# EAGLE design Diplexer (EAGLE 7.1.0)
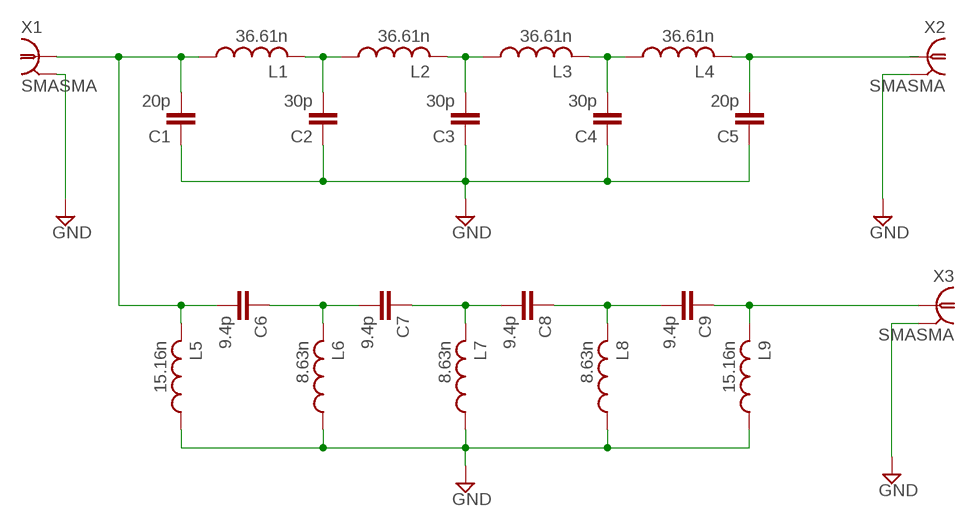
[diagram p0: schematic, sheet 1]

## Parts
C1  20p  C-EUC1206  [C1206]
C2  30p  C-EUC1206  [C1206]
C3  30p  C-EUC1206  [C1206]
C4  30p  C-EUC1206  [C1206]
C5  20p  C-EUC1206  [C1206]
C6  9.4p  C-EUC1206  [C1206]
C7  9.4p  C-EUC1206  [C1206]
C8  9.4p  C-EUC1206  [C1206]
C9  9.4p  C-EUC1206  [C1206]
L1  36.61n  AIR_CORE_INDUCTORL1812  [AIR_CORE_INDUCTOR]
L2  36.61n  AIR_CORE_INDUCTORL1812  [AIR_CORE_INDUCTOR]
L3  36.61n  AIR_CORE_INDUCTORL1812  [AIR_CORE_INDUCTOR]
L4  36.61n  AIR_CORE_INDUCTORL1812  [AIR_CORE_INDUCTOR]
L5  15.16n  AIR_CORE_INDUCTORL1812  [AIR_CORE_INDUCTOR]
L6  8.63n  AIR_CORE_INDUCTORL1812  [AIR_CORE_INDUCTOR]
L7  8.63n  AIR_CORE_INDUCTORL1812  [AIR_CORE_INDUCTOR]
L8  8.63n  AIR_CORE_INDUCTORL1812  [AIR_CORE_INDUCTOR]
L9  15.16n  AIR_CORE_INDUCTORL1812  [AIR_CORE_INDUCTOR]
X1  SMASMA  [SMA]
X2  SMASMA  [SMA]
X3  SMASMA  [SMA]

## Nets
GND: C1.1 C2.1 C3.1 C4.1 C5.1 L5.1 L6.1 L7.1 L8.1 L9.1 X1.2 X1.4 X2.2 X2.4 X3.2 X3.4
N$1: C1.2 C6.2 L1.1 L5.2 X1.1
N$2: C2.2 L1.2 L2.1
N$3: C3.2 L2.2 L3.1
N$4: C4.2 L3.2 L4.1
N$5: C5.2 L4.2 X2.1
N$8: C6.1 C7.2 L6.2
N$9: C7.1 C8.2 L7.2
N$10: C8.1 C9.2 L8.2
N$11: C9.1 L9.2 X3.1

## Library data of the parts
C1-C9 = satnogs:C-EU: CAPACITOR, European symbol
L1-L9 = satnogs:AIR_CORE_INDUCTOR: INDUCTOR
X1-X3 = satnogs:SMA: SMA CONNECTOR 50 Ohm

## Board
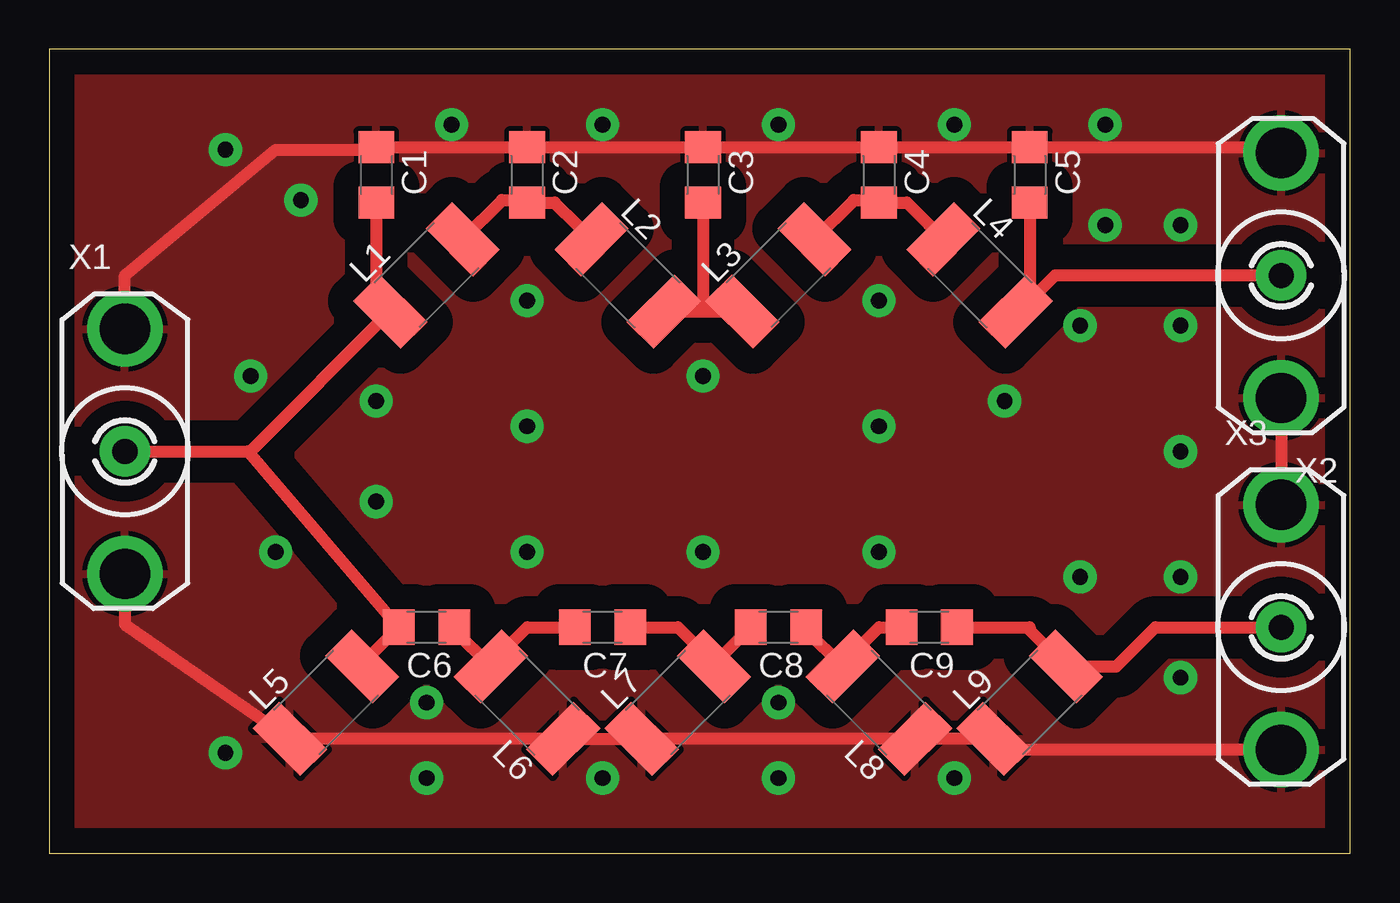
[diagram p1: board, top side]
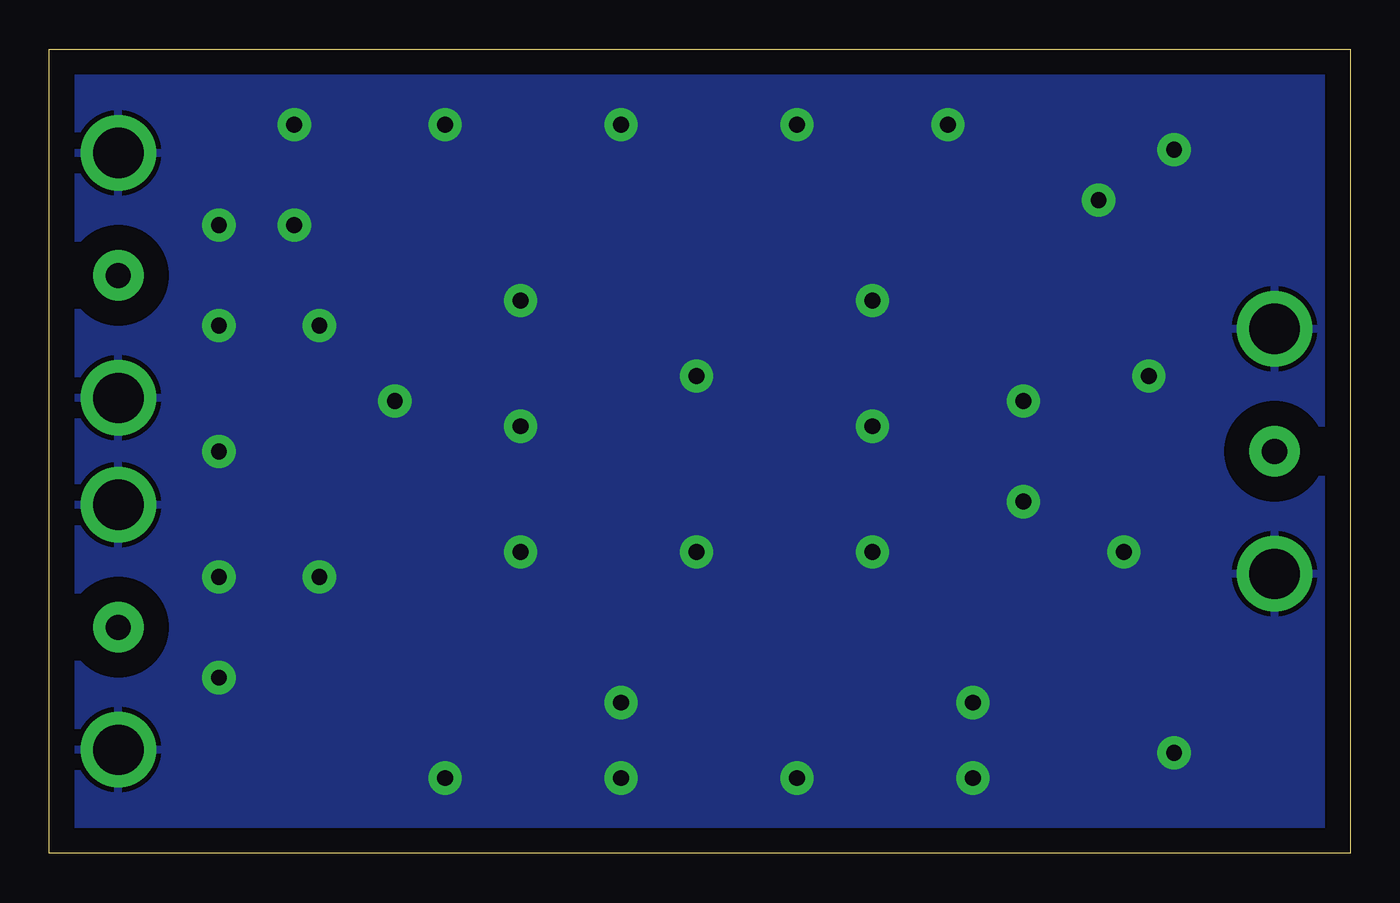
[diagram p2: board, bottom side, seen from below]

Size 65.71 x 40.63 mm. Coordinates in mm from the lower left corner, seen from the top.
Outline: 0,0 65.71,0 65.71,40.63 0,40.63 0,0
Copper layers (1*16): Top 0.035mm / dielectric 1.5mm / Bottom 0.035mm
Design rules "default": minimum track width 10mil, minimum drill 24mil, track to track 8mil, track to pad 8mil, pad to pad 8mil, via to via 8mil, smd to smd 8mil, copper to edge 40mil, drill to drill 8mil, minimum pad ring 10mil, minimum via ring 8mil, stop-mask expansion 4mil, vias tented up to drill 0mil, thermal gap 10mil

### Footprints (pad centres in the part's own frame; a part is rotated, then mirrored left to right if it is on the bottom)
C1206 = smd 1.6 x 1.8: 1 -1.4,0; 2 1.4,0
AIR_CORE_INDUCTOR = smd 1.9 x 3.4: 1 -2.585,0; 2 2.585,0
SMA = drill 1.27 pad 2.54: 1 0,0 | drill 2.54 pad 3.81: 2 0,6.191; 4 0,-6.191

### Placement (x,y rotation side)
C1  16.51,34.29 270 top
C2  24.13,34.29 270 top
C3  33.02,34.29 270 top
C4  41.91,34.29 270 top
C5  49.53,34.29 270 top
C6  19.05,11.43 180 top
C7  27.94,11.43 180 top
C8  36.83,11.43 180 top
C9  44.45,11.43 180 top
L1  19.05,29.21 45 top
L2  29.21,29.21 315 top
L3  36.83,29.21 45 top
L4  46.99,29.21 315 top
L5  13.97,7.62 45 top
L6  24.13,7.62 135 top
L7  31.75,7.62 45 top
L8  41.91,7.62 135 top
L9  49.53,7.62 45 top
X1  3.81,20.32 0 top
X2  62.23,29.21 180 top
X3  62.23,11.43 0 top

### Tracks (layer width: path | path; a pad name or v marks a point on that pad's centre or on a via)
GND  (via drill 0.8 pad 1.68)
  Top 0.61: X3.4 48.26,5.24 L9.1 L8.1 L7.1 L6.1 L5.1 3.81,11.58 X1.4 | X2.2 X3.2 | X2.4 61.94,35.69 C5.1 C4.1 C3.1 C2.1 C1.1 16.38,35.56 11.43,35.56 3.81,29.21 X1.2
  other vias: 16.51,22.86 16.51,17.78 24.13,15.24 24.13,21.59 24.13,27.94 33.02,24.13 33.02,15.24 41.91,21.59 41.91,27.94 41.91,15.24 48.26,22.86 52.07,13.97 52.07,26.67 53.34,31.75 53.34,36.83 45.72,36.83 36.83,36.83 27.94,36.83 20.32,36.83 8.89,35.56 12.7,33.02 8.89,5.08 19.05,7.62 19.05,3.81 27.94,3.81 36.83,7.62 36.83,3.81 45.72,3.81 57.15,31.75 57.15,8.89 57.15,26.67 57.15,20.32 57.15,13.97 10.16,24.13 11.43,15.24
  pour Bottom (isolate 1.27): 0,40.64 0,0 66.04,0 66.04,40.64
  pour Top (isolate 1.27): 0,40.64 0,0 66.04,0 66.04,40.64
N$1
  Top 0.61: C1.2 16.51,28.09 L1.1 10.16,20.32 10.03,20.32 | L5.2 15.8,9.58 C6.2 10.03,20.32 | X1.1 10.03,20.32
N$2
  Top 0.61: L1.2 22.86,33.02 24,33.02 C2.2 25.53,32.89 26.67,31.75 | 26.67,31.75 | 26.67,31.75 L2.1
N$3
  Top 0.61: L2.2 33.02,27.38 | 33.02,27.38 L3.1 | C3.2 33.02,27.38
N$4
  Top 0.61: L3.2 40.64,33.02 41.78,33.02 C4.2 43.31,32.89 44.45,31.75 | 44.45,31.75 | 44.45,31.75 L4.1
N$5
  Top 0.61: C5.2 49.53,27.94 | 49.53,27.94 49.38,27.94 L4.2 | X2.1 50.8,29.21 49.53,27.94
N$8
  Top 0.61: C6.1 20.45,11.3 L6.2 22.3,9.6 24.13,11.43 C7.2
N$9
  Top 0.61: C7.1 31.75,11.43 33.02,10.16 33.02,10.01 L7.2 33.58,9.58 C8.2
N$10
  Top 0.61: C8.1 38.23,11.3 L8.2 40.08,9.6 41.91,11.43 C9.2
N$11
  Top 0.61: C9.1 49.53,11.43 49.53,11.28 L9.2 53.9,9.45 55.88,11.43 X3.1